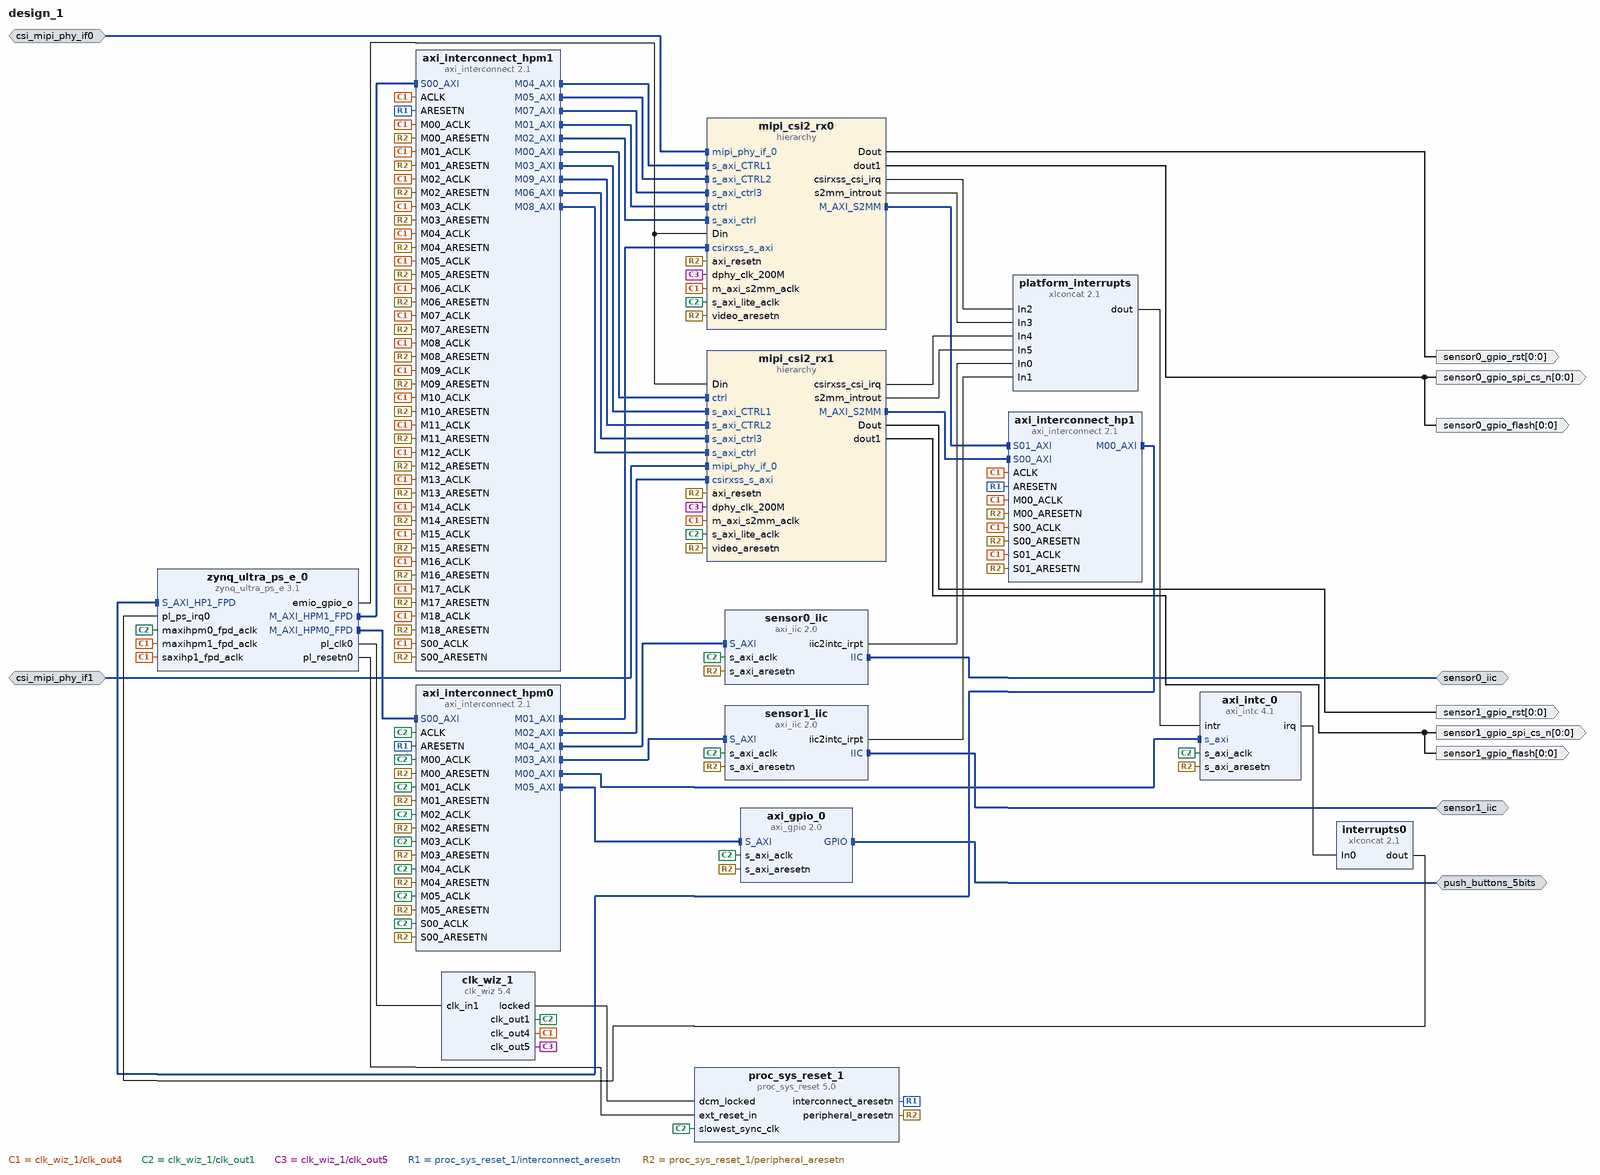
[diagram p0: block diagram of the top level]
# Vivado block design design_1, xczu9eg-ffvb1156-2-i, Vivado 2017.3
create_bd_design design_1

create_bd_intf_port -mode Slave -vlnv xilinx.com:interface:mipi_phy_rtl:1.0 csi_mipi_phy_if0
create_bd_intf_port -mode Slave -vlnv xilinx.com:interface:mipi_phy_rtl:1.0 csi_mipi_phy_if1
create_bd_intf_port -mode Master -vlnv xilinx.com:interface:gpio_rtl:1.0 push_buttons_5bits
create_bd_intf_port -mode Master -vlnv xilinx.com:interface:iic_rtl:1.0 sensor0_iic
create_bd_intf_port -mode Master -vlnv xilinx.com:interface:iic_rtl:1.0 sensor1_iic
create_bd_port -dir O -from 0 -to 0 sensor0_gpio_flash
create_bd_port -dir O -from 0 -to 0 sensor0_gpio_rst
create_bd_port -dir O -from 0 -to 0 sensor0_gpio_spi_cs_n
create_bd_port -dir O -from 0 -to 0 sensor1_gpio_flash
create_bd_port -dir O -from 0 -to 0 sensor1_gpio_rst
create_bd_port -dir O -from 0 -to 0 sensor1_gpio_spi_cs_n

create_bd_cell -type ip -vlnv xilinx.com:ip:axi_gpio:2.0 axi_gpio_0
set_property -dict {CONFIG.USE_BOARD_FLOW true CONFIG.GPIO_BOARD_INTERFACE push_buttons_5bits} [get_bd_cells axi_gpio_0]
create_bd_cell -type ip -vlnv xilinx.com:ip:axi_intc:4.1 axi_intc_0
create_bd_cell -type ip -vlnv xilinx.com:ip:axi_interconnect:2.1 axi_interconnect_hp1
set_property -dict [list \
  CONFIG.NUM_SI 2 \
  CONFIG.NUM_MI 1 \
  CONFIG.STRATEGY 2 \
  CONFIG.ENABLE_ADVANCED_OPTIONS 0 \
  CONFIG.SYNCHRONIZATION_STAGES 2 \
  CONFIG.M00_HAS_REGSLICE 1 \
  CONFIG.M00_HAS_DATA_FIFO 2 \
  CONFIG.S00_HAS_REGSLICE 1 \
  CONFIG.S01_HAS_REGSLICE 1 \
  CONFIG.S02_HAS_REGSLICE 1 \
  CONFIG.S03_HAS_REGSLICE 1 \
  CONFIG.S04_HAS_REGSLICE 1 \
  CONFIG.S05_HAS_REGSLICE 1 \
  CONFIG.S06_HAS_REGSLICE 1 \
  CONFIG.S00_HAS_DATA_FIFO 2 \
  CONFIG.S01_HAS_DATA_FIFO 2 \
  CONFIG.S02_HAS_DATA_FIFO 2 \
  CONFIG.S03_HAS_DATA_FIFO 2 \
  CONFIG.S04_HAS_DATA_FIFO 2 \
  CONFIG.S05_HAS_DATA_FIFO 2 \
  CONFIG.S06_HAS_DATA_FIFO 2 \
] [get_bd_cells axi_interconnect_hp1]
create_bd_cell -type ip -vlnv xilinx.com:ip:axi_interconnect:2.1 axi_interconnect_hpm0
set_property -dict [list \
  CONFIG.NUM_MI 6 \
  CONFIG.STRATEGY 1 \
  CONFIG.ENABLE_ADVANCED_OPTIONS 0 \
  CONFIG.SYNCHRONIZATION_STAGES 2 \
] [get_bd_cells axi_interconnect_hpm0]
create_bd_cell -type ip -vlnv xilinx.com:ip:axi_interconnect:2.1 axi_interconnect_hpm1
set_property -dict [list \
  CONFIG.NUM_MI 19 \
  CONFIG.STRATEGY 1 \
  CONFIG.ENABLE_ADVANCED_OPTIONS 0 \
  CONFIG.SYNCHRONIZATION_STAGES 2 \
  CONFIG.M00_HAS_REGSLICE 1 \
  CONFIG.M01_HAS_REGSLICE 1 \
  CONFIG.M02_HAS_REGSLICE 1 \
  CONFIG.M03_HAS_REGSLICE 1 \
  CONFIG.M04_HAS_REGSLICE 1 \
  CONFIG.M05_HAS_REGSLICE 1 \
  CONFIG.M06_HAS_REGSLICE 1 \
  CONFIG.M07_HAS_REGSLICE 1 \
  CONFIG.M08_HAS_REGSLICE 1 \
  CONFIG.M09_HAS_REGSLICE 1 \
  CONFIG.M10_HAS_REGSLICE 1 \
  CONFIG.S00_HAS_REGSLICE 1 \
] [get_bd_cells axi_interconnect_hpm1]
create_bd_cell -type ip -vlnv xilinx.com:ip:clk_wiz:5.4 clk_wiz_1
set_property -dict [list \
  CONFIG.PHASESHIFT_MODE LATENCY \
  CONFIG.USE_INCLK_SWITCHOVER false \
  CONFIG.CLKIN1_JITTER_PS 200.02 \
  CONFIG.CLKOUT2_USED true \
  CONFIG.CLKOUT3_USED true \
  CONFIG.CLKOUT4_USED true \
  CONFIG.CLKOUT5_USED true \
  CONFIG.NUM_OUT_CLKS 5 \
  CONFIG.CLKOUT1_REQUESTED_OUT_FREQ 50.000 \
  CONFIG.CLKOUT2_REQUESTED_OUT_FREQ 75.000 \
  CONFIG.CLKOUT3_REQUESTED_OUT_FREQ 150.000 \
  CONFIG.CLKOUT4_REQUESTED_OUT_FREQ 300.000 \
  CONFIG.CLKOUT5_REQUESTED_OUT_FREQ 200.000 \
  CONFIG.PRIM_SOURCE No_buffer \
  CONFIG.CLKOUT1_DRIVES Buffer \
  CONFIG.CLKOUT2_DRIVES Buffer \
  CONFIG.CLKOUT3_DRIVES Buffer \
  CONFIG.CLKOUT4_DRIVES Buffer \
  CONFIG.CLKOUT5_DRIVES Buffer \
  CONFIG.CLKOUT6_DRIVES Buffer \
  CONFIG.CLKOUT7_DRIVES Buffer \
  CONFIG.USE_RESET false \
  CONFIG.MMCM_DIVCLK_DIVIDE 1 \
  CONFIG.MMCM_CLKFBOUT_MULT_F 24.000 \
  CONFIG.MMCM_CLKIN1_PERIOD 20.002 \
  CONFIG.MMCM_CLKIN2_PERIOD 10.0 \
  CONFIG.MMCM_CLKOUT0_DIVIDE_F 24.000 \
  CONFIG.MMCM_CLKOUT1_DIVIDE 16 \
  CONFIG.MMCM_CLKOUT2_DIVIDE 8 \
  CONFIG.MMCM_CLKOUT3_DIVIDE 4 \
  CONFIG.MMCM_CLKOUT4_DIVIDE 6 \
  CONFIG.CLKOUT1_JITTER 163.726 \
  CONFIG.CLKOUT1_PHASE_ERROR 154.695 \
  CONFIG.CLKOUT2_JITTER 148.390 \
  CONFIG.CLKOUT2_PHASE_ERROR 154.695 \
  CONFIG.CLKOUT3_JITTER 129.940 \
  CONFIG.CLKOUT3_PHASE_ERROR 154.695 \
  CONFIG.CLKOUT4_JITTER 116.512 \
  CONFIG.CLKOUT4_PHASE_ERROR 154.695 \
  CONFIG.CLKOUT5_JITTER 124.151 \
  CONFIG.CLKOUT5_PHASE_ERROR 154.695 \
] [get_bd_cells clk_wiz_1]
create_bd_cell -type ip -vlnv xilinx.com:ip:xlconcat:2.1 interrupts0
set_property -dict {CONFIG.NUM_PORTS 1} [get_bd_cells interrupts0]
create_bd_cell -type hier mipi_csi2_rx0
create_bd_cell -type hier mipi_csi2_rx1
create_bd_cell -type ip -vlnv xilinx.com:ip:xlconcat:2.1 platform_interrupts
set_property -dict {CONFIG.NUM_PORTS 6} [get_bd_cells platform_interrupts]
create_bd_cell -type ip -vlnv xilinx.com:ip:proc_sys_reset:5.0 proc_sys_reset_1
set_property -dict {CONFIG.C_AUX_RESET_HIGH 0} [get_bd_cells proc_sys_reset_1]
create_bd_cell -type ip -vlnv xilinx.com:ip:axi_iic:2.0 sensor0_iic
set_property -dict {CONFIG.IIC_FREQ_KHZ 400} [get_bd_cells sensor0_iic]
create_bd_cell -type ip -vlnv xilinx.com:ip:axi_iic:2.0 sensor1_iic
set_property -dict {CONFIG.IIC_FREQ_KHZ 400} [get_bd_cells sensor1_iic]
create_bd_cell -type ip -vlnv xilinx.com:ip:zynq_ultra_ps_e:3.1 zynq_ultra_ps_e_0
set_property -dict [list \
  CONFIG.PSU__PSS_REF_CLK__FREQMHZ 33.330 \
  CONFIG.PSU__CAN1__PERIPHERAL__ENABLE 1 \
  CONFIG.PSU__CAN1__PERIPHERAL__IO {MIO 24 .. 25} \
  CONFIG.PSU__DPAUX__PERIPHERAL__ENABLE 1 \
  CONFIG.PSU__DPAUX__PERIPHERAL__IO {MIO 27 .. 30} \
  CONFIG.PSU__GEM__TSU__ENABLE 0 \
  CONFIG.PSU__FPGA_PL0_ENABLE 1 \
  CONFIG.PSU__ENET3__PERIPHERAL__ENABLE 1 \
  CONFIG.PSU__ENET3__FIFO__ENABLE 0 \
  CONFIG.PSU__ENET3__PTP__ENABLE 0 \
  CONFIG.PSU__ENET3__PERIPHERAL__IO {MIO 64 .. 75} \
  CONFIG.PSU__ENET3__GRP_MDIO__ENABLE 1 \
  CONFIG.PSU__ENET3__GRP_MDIO__IO {MIO 76 .. 77} \
  CONFIG.PSU__GPIO_EMIO__PERIPHERAL__ENABLE 1 \
  CONFIG.PSU__GPIO_EMIO__PERIPHERAL__IO 95 \
  CONFIG.PSU__GPIO0_MIO__PERIPHERAL__ENABLE 1 \
  CONFIG.PSU__GPIO0_MIO__IO {MIO 0 .. 25} \
  CONFIG.PSU__GPIO1_MIO__PERIPHERAL__ENABLE 1 \
  CONFIG.PSU__GPIO1_MIO__IO {MIO 26 .. 51} \
  CONFIG.PSU__I2C0__PERIPHERAL__ENABLE 1 \
  CONFIG.PSU__I2C0__PERIPHERAL__IO {MIO 14 .. 15} \
  CONFIG.PSU__I2C1__PERIPHERAL__ENABLE 1 \
  CONFIG.PSU__I2C1__PERIPHERAL__IO {MIO 16 .. 17} \
  CONFIG.PSU__GT__LINK_SPEED HBR \
  CONFIG.PSU__GT__VLT_SWNG_LVL_4 0 \
  CONFIG.PSU__GT__PRE_EMPH_LVL_4 0 \
  CONFIG.PSU__USB0__REF_CLK_SEL {Ref Clk2} \
  CONFIG.PSU__USB0__REF_CLK_FREQ 26 \
  CONFIG.PSU__DP__REF_CLK_SEL {Ref Clk3} \
  CONFIG.PSU__DP__REF_CLK_FREQ 27 \
  CONFIG.PSU__SATA__REF_CLK_SEL {Ref Clk1} \
  CONFIG.PSU__SATA__REF_CLK_FREQ 125 \
  CONFIG.PSU__DP__LANE_SEL {Dual Lower} \
  CONFIG.PSU__PCIE__DEVICE_ID 0xD021 \
  CONFIG.PSU__PCIE__CLASS_CODE_BASE 0x06 \
  CONFIG.PSU__PCIE__CLASS_CODE_SUB 0x4 \
  CONFIG.SUBPRESET2 Custom \
  CONFIG.PSU__PMU__AIBACK__ENABLE 0 \
  CONFIG.PSU__PMU__PLERROR__ENABLE 0 \
  CONFIG.PSU__PMU__PERIPHERAL__ENABLE 1 \
  CONFIG.PSU__PMU__EMIO_GPI__ENABLE 0 \
  CONFIG.PSU__PMU__EMIO_GPO__ENABLE 0 \
  CONFIG.PSU__PMU__GPI0__ENABLE 0 \
  CONFIG.PSU__PMU__GPI1__ENABLE 0 \
  CONFIG.PSU__PMU__GPI2__ENABLE 0 \
  CONFIG.PSU__PMU__GPI3__ENABLE 0 \
  CONFIG.PSU__PMU__GPI4__ENABLE 0 \
  CONFIG.PSU__PMU__GPI5__ENABLE 0 \
  CONFIG.PSU__PMU__GPO0__ENABLE 1 \
  CONFIG.PSU__PMU__GPO1__ENABLE 1 \
  CONFIG.PSU__PMU__GPO2__ENABLE 1 \
  CONFIG.PSU__PMU__GPO3__ENABLE 1 \
  CONFIG.PSU__PMU__GPO4__ENABLE 1 \
  CONFIG.PSU__PMU__GPO5__ENABLE 1 \
  CONFIG.PSU__PMU__GPO0__IO {MIO 32} \
  CONFIG.PSU__PMU__GPO1__IO {MIO 33} \
  CONFIG.PSU__PMU__GPO2__IO {MIO 34} \
  CONFIG.PSU__PMU__GPO3__IO {MIO 35} \
  CONFIG.PSU__PMU__GPO4__IO {MIO 36} \
  CONFIG.PSU__PMU__GPO5__IO {MIO 37} \
  CONFIG.PSU__QSPI__PERIPHERAL__ENABLE 1 \
  CONFIG.PSU__QSPI__PERIPHERAL__IO {MIO 0 .. 12} \
  CONFIG.PSU__QSPI__PERIPHERAL__MODE {Dual Parallel} \
  CONFIG.PSU__QSPI__PERIPHERAL__DATA_MODE x4 \
  CONFIG.PSU__QSPI__GRP_FBCLK__ENABLE 1 \
  CONFIG.PSU__QSPI__GRP_FBCLK__IO {MIO 6} \
  CONFIG.PSU__SD1__PERIPHERAL__ENABLE 1 \
  CONFIG.PSU__SD1__PERIPHERAL__IO {MIO 39 .. 51} \
  CONFIG.PSU__SD1__GRP_CD__ENABLE 1 \
  CONFIG.PSU__SD1__GRP_CD__IO {MIO 45} \
  CONFIG.PSU__SD1__GRP_POW__ENABLE 0 \
  CONFIG.PSU__SD1__GRP_WP__ENABLE 1 \
  CONFIG.PSU__SD1__GRP_WP__IO {MIO 44} \
  CONFIG.PSU__SD1__SLOT_TYPE {SD 3.0} \
  CONFIG.PSU__SD1__DATA_TRANSFER_MODE 8Bit \
  CONFIG.PSU__DEVICE_TYPE EG \
  CONFIG.PSU__SWDT0__PERIPHERAL__ENABLE 1 \
  CONFIG.PSU__SWDT0__CLOCK__ENABLE 0 \
  CONFIG.PSU__SWDT0__RESET__ENABLE 0 \
  CONFIG.PSU__SWDT1__PERIPHERAL__ENABLE 1 \
  CONFIG.PSU__SWDT1__CLOCK__ENABLE 0 \
  CONFIG.PSU__SWDT1__RESET__ENABLE 0 \
  CONFIG.PSU__UART0__BAUD_RATE 115200 \
  CONFIG.PSU__TTC0__PERIPHERAL__ENABLE 1 \
  CONFIG.PSU__TTC0__CLOCK__ENABLE 0 \
  CONFIG.PSU__TTC0__WAVEOUT__ENABLE 0 \
  CONFIG.PSU__TTC1__PERIPHERAL__ENABLE 1 \
  CONFIG.PSU__UART1__BAUD_RATE 115200 \
  CONFIG.PSU__TTC1__CLOCK__ENABLE 0 \
  CONFIG.PSU__TTC1__WAVEOUT__ENABLE 0 \
  CONFIG.PSU__TTC2__PERIPHERAL__ENABLE 1 \
  CONFIG.PSU__TTC2__CLOCK__ENABLE 0 \
  CONFIG.PSU__TTC2__WAVEOUT__ENABLE 0 \
  CONFIG.PSU__TTC3__PERIPHERAL__ENABLE 1 \
  CONFIG.PSU__TTC3__CLOCK__ENABLE 0 \
  CONFIG.PSU__TTC3__WAVEOUT__ENABLE 0 \
  CONFIG.PSU__CSUPMU__PERIPHERAL__VALID 1 \
  CONFIG.PSU__DDRC__BUS_WIDTH {64 Bit} \
  CONFIG.PSU__DDRC__DEVICE_CAPACITY {4096 MBits} \
  CONFIG.PSU__DDRC__DRAM_WIDTH {8 Bits} \
  CONFIG.PSU__DDRC__ECC Disabled \
  CONFIG.PSU__DDRC__MEMORY_TYPE {DDR 4} \
  CONFIG.PSU__DDRC__SPEED_BIN DDR4_2133P \
  CONFIG.PSU__DDRC__COMPONENTS UDIMM \
  CONFIG.PSU__UART0__PERIPHERAL__ENABLE 1 \
  CONFIG.PSU__UART0__PERIPHERAL__IO {MIO 18 .. 19} \
  CONFIG.PSU__UART0__MODEM__ENABLE 0 \
  CONFIG.PSU__UART1__PERIPHERAL__ENABLE 1 \
  CONFIG.PSU__UART1__PERIPHERAL__IO {MIO 20 .. 21} \
  CONFIG.PSU__UART1__MODEM__ENABLE 0 \
  CONFIG.PSU__USB0__PERIPHERAL__ENABLE 1 \
  CONFIG.PSU__USB0__PERIPHERAL__IO {MIO 52 .. 63} \
  CONFIG.PSU__USB3_0__PERIPHERAL__ENABLE 1 \
  CONFIG.PSU__USB3_0__PERIPHERAL__IO {GT Lane2} \
  CONFIG.PSU__USB3_0__EMIO__ENABLE 0 \
  CONFIG.PSU__USB2_0__EMIO__ENABLE 0 \
  CONFIG.PSU__USE__M_AXI_GP0 1 \
  CONFIG.PSU__MAXIGP0__DATA_WIDTH 32 \
  CONFIG.PSU__USE__M_AXI_GP1 1 \
  CONFIG.PSU__MAXIGP1__DATA_WIDTH 32 \
  CONFIG.PSU__USE__M_AXI_GP2 0 \
  CONFIG.PSU__USE__S_AXI_GP3 1 \
  CONFIG.PSU__USE__IRQ0 1 \
  CONFIG.PSU__PRESET_APPLIED 1 \
  CONFIG.PSU__HIGH_ADDRESS__ENABLE 1 \
  CONFIG.PSU__DDR_HIGH_ADDRESS_GUI_ENABLE 1 \
  CONFIG.PSU_BANK_0_IO_STANDARD LVCMOS18 \
  CONFIG.PSU_BANK_1_IO_STANDARD LVCMOS18 \
  CONFIG.PSU_BANK_2_IO_STANDARD LVCMOS18 \
  CONFIG.PSU_BANK_3_IO_STANDARD LVCMOS33 \
  CONFIG.PSU__DISPLAYPORT__PERIPHERAL__ENABLE 1 \
  CONFIG.PSU__DISPLAYPORT__LANE0__ENABLE 1 \
  CONFIG.PSU__DISPLAYPORT__LANE0__IO {GT Lane1} \
  CONFIG.PSU__DISPLAYPORT__LANE1__ENABLE 1 \
  CONFIG.PSU__DISPLAYPORT__LANE1__IO {GT Lane0} \
  CONFIG.PSU__SATA__PERIPHERAL__ENABLE 1 \
  CONFIG.PSU__SATA__LANE1__IO {GT Lane3} \
  CONFIG.PSU__CRL_APB__USB3__ENABLE 1 \
  CONFIG.PSU__CRF_APB__APLL_CTRL__SRCSEL PSS_REF_CLK \
  CONFIG.PSU__CRF_APB__DPLL_CTRL__SRCSEL PSS_REF_CLK \
  CONFIG.PSU__CRF_APB__VPLL_CTRL__SRCSEL PSS_REF_CLK \
  CONFIG.PSU__CRF_APB__ACPU_CTRL__SRCSEL APLL \
  CONFIG.PSU__CRF_APB__DBG_TRACE_CTRL__SRCSEL IOPLL \
  CONFIG.PSU__CRF_APB__DBG_FPD_CTRL__SRCSEL IOPLL \
  CONFIG.PSU__CRF_APB__DP_VIDEO_REF_CTRL__SRCSEL VPLL \
  CONFIG.PSU__CRF_APB__DP_AUDIO_REF_CTRL__SRCSEL RPLL \
  CONFIG.PSU__CRF_APB__DP_STC_REF_CTRL__SRCSEL RPLL \
  CONFIG.PSU__CRF_APB__DDR_CTRL__SRCSEL DPLL \
  CONFIG.PSU__CRF_APB__GPU_REF_CTRL__SRCSEL IOPLL \
  CONFIG.PSU__CRL_APB__PL0_REF_CTRL__SRCSEL IOPLL \
  CONFIG.PSU__CRF_APB__GDMA_REF_CTRL__SRCSEL APLL \
  CONFIG.PSU__CRF_APB__DPDMA_REF_CTRL__SRCSEL APLL \
  CONFIG.PSU__CRF_APB__TOPSW_MAIN_CTRL__SRCSEL DPLL \
  CONFIG.PSU__CRF_APB__TOPSW_LSBUS_CTRL__SRCSEL IOPLL \
  CONFIG.PSU__CRF_APB__DBG_TSTMP_CTRL__SRCSEL IOPLL \
  CONFIG.PSU__CRL_APB__IOPLL_CTRL__SRCSEL PSS_REF_CLK \
  CONFIG.PSU__CRL_APB__RPLL_CTRL__SRCSEL PSS_REF_CLK \
  CONFIG.PSU__CRL_APB__GEM3_REF_CTRL__SRCSEL IOPLL \
  CONFIG.PSU__CRL_APB__USB0_BUS_REF_CTRL__SRCSEL IOPLL \
  CONFIG.PSU__CRL_APB__QSPI_REF_CTRL__SRCSEL IOPLL \
  CONFIG.PSU__CRL_APB__SDIO1_REF_CTRL__SRCSEL IOPLL \
  CONFIG.PSU__CRL_APB__UART0_REF_CTRL__SRCSEL IOPLL \
  CONFIG.PSU__CRL_APB__UART1_REF_CTRL__SRCSEL IOPLL \
  CONFIG.PSU__CRL_APB__I2C0_REF_CTRL__SRCSEL IOPLL \
  CONFIG.PSU__CRL_APB__I2C1_REF_CTRL__SRCSEL IOPLL \
  CONFIG.PSU__CRL_APB__CAN1_REF_CTRL__SRCSEL IOPLL \
  CONFIG.PSU__CRL_APB__CPU_R5_CTRL__SRCSEL IOPLL \
  CONFIG.PSU__CRL_APB__IOU_SWITCH_CTRL__SRCSEL IOPLL \
  CONFIG.PSU__CRL_APB__PCAP_CTRL__SRCSEL IOPLL \
  CONFIG.PSU__CRL_APB__LPD_LSBUS_CTRL__SRCSEL IOPLL \
  CONFIG.PSU__CRL_APB__LPD_SWITCH_CTRL__SRCSEL IOPLL \
  CONFIG.PSU__CRL_APB__DBG_LPD_CTRL__SRCSEL IOPLL \
  CONFIG.PSU__CRL_APB__ADMA_REF_CTRL__SRCSEL IOPLL \
  CONFIG.PSU__CRL_APB__TIMESTAMP_REF_CTRL__SRCSEL IOPLL \
  CONFIG.PSU__CRL_APB__USB3_DUAL_REF_CTRL__SRCSEL IOPLL \
  CONFIG.PSU__IOU_SLCR__IOU_TTC_APB_CLK__TTC0_SEL APB \
  CONFIG.PSU__IOU_SLCR__IOU_TTC_APB_CLK__TTC1_SEL APB \
  CONFIG.PSU__IOU_SLCR__IOU_TTC_APB_CLK__TTC2_SEL APB \
  CONFIG.PSU__IOU_SLCR__IOU_TTC_APB_CLK__TTC3_SEL APB \
  CONFIG.PSU__OVERRIDE__BASIC_CLOCK 0 \
  CONFIG.PSU__DLL__ISUSED 1 \
  CONFIG.PSU__DDR__INTERFACE__FREQMHZ 533.500 \
  CONFIG.PSU__CRF_APB__ACPU_CTRL__FREQMHZ 1200 \
  CONFIG.PSU__CRF_APB__DBG_TRACE_CTRL__FREQMHZ 250 \
  CONFIG.PSU__CRF_APB__DBG_FPD_CTRL__FREQMHZ 250 \
  CONFIG.PSU__CRF_APB__DDR_CTRL__FREQMHZ 1067 \
  CONFIG.PSU__CRF_APB__GPU_REF_CTRL__FREQMHZ 500 \
  CONFIG.PSU__CRL_APB__PL0_REF_CTRL__FREQMHZ 50 \
  CONFIG.PSU__CRF_APB__GDMA_REF_CTRL__FREQMHZ 600 \
  CONFIG.PSU__CRF_APB__DPDMA_REF_CTRL__FREQMHZ 600 \
  CONFIG.PSU__CRF_APB__TOPSW_MAIN_CTRL__FREQMHZ 533.33 \
  CONFIG.PSU__CRF_APB__TOPSW_LSBUS_CTRL__FREQMHZ 100 \
  CONFIG.PSU__CRF_APB__DBG_TSTMP_CTRL__FREQMHZ 250 \
  CONFIG.PSU__CRL_APB__GEM3_REF_CTRL__FREQMHZ 125 \
  CONFIG.PSU__CRL_APB__USB0_BUS_REF_CTRL__FREQMHZ 250 \
  CONFIG.PSU__CRL_APB__QSPI_REF_CTRL__FREQMHZ 125 \
  CONFIG.PSU__CRL_APB__SDIO1_REF_CTRL__FREQMHZ 200 \
  CONFIG.PSU__CRL_APB__UART0_REF_CTRL__FREQMHZ 100 \
  CONFIG.PSU__CRL_APB__UART1_REF_CTRL__FREQMHZ 100 \
  CONFIG.PSU__CRL_APB__I2C0_REF_CTRL__FREQMHZ 100 \
  CONFIG.PSU__CRL_APB__I2C1_REF_CTRL__FREQMHZ 100 \
  CONFIG.PSU__CRL_APB__CAN1_REF_CTRL__FREQMHZ 100 \
  CONFIG.PSU__CRL_APB__CPU_R5_CTRL__FREQMHZ 500 \
  CONFIG.PSU__CRL_APB__IOU_SWITCH_CTRL__FREQMHZ 250 \
  CONFIG.PSU__CRL_APB__PCAP_CTRL__FREQMHZ 200 \
  CONFIG.PSU__CRL_APB__LPD_LSBUS_CTRL__FREQMHZ 100 \
  CONFIG.PSU__CRL_APB__LPD_SWITCH_CTRL__FREQMHZ 500 \
  CONFIG.PSU__CRL_APB__DBG_LPD_CTRL__FREQMHZ 250 \
  CONFIG.PSU__CRL_APB__ADMA_REF_CTRL__FREQMHZ 500 \
  CONFIG.PSU__CRL_APB__TIMESTAMP_REF_CTRL__FREQMHZ 100 \
  CONFIG.PSU__CRL_APB__USB3_DUAL_REF_CTRL__FREQMHZ 20 \
  CONFIG.PSU__LPD_SLCR__CSUPMU__FREQMHZ 100 \
  CONFIG.PSU__GPIO_EMIO_WIDTH 95 \
  CONFIG.IIC0_BOARD_INTERFACE custom \
  CONFIG.IIC1_BOARD_INTERFACE custom \
  CONFIG.QSPI_BOARD_INTERFACE custom \
  CONFIG.NAND_BOARD_INTERFACE custom \
  CONFIG.SD0_BOARD_INTERFACE custom \
  CONFIG.SD1_BOARD_INTERFACE custom \
  CONFIG.CAN0_BOARD_INTERFACE custom \
  CONFIG.CAN1_BOARD_INTERFACE custom \
  CONFIG.PJTAG_BOARD_INTERFACE custom \
  CONFIG.PMU_BOARD_INTERFACE custom \
  CONFIG.CSU_BOARD_INTERFACE custom \
  CONFIG.SPI0_BOARD_INTERFACE custom \
  CONFIG.SPI1_BOARD_INTERFACE custom \
  CONFIG.UART0_BOARD_INTERFACE custom \
  CONFIG.UART1_BOARD_INTERFACE custom \
  CONFIG.GPIO_BOARD_INTERFACE custom \
  CONFIG.SWDT0_BOARD_INTERFACE custom \
  CONFIG.SWDT1_BOARD_INTERFACE custom \
  CONFIG.TRACE_BOARD_INTERFACE custom \
  CONFIG.TTC0_BOARD_INTERFACE custom \
  CONFIG.TTC1_BOARD_INTERFACE custom \
  CONFIG.TTC2_BOARD_INTERFACE custom \
  CONFIG.TTC3_BOARD_INTERFACE custom \
  CONFIG.GEM0_BOARD_INTERFACE custom \
  CONFIG.GEM1_BOARD_INTERFACE custom \
  CONFIG.GEM2_BOARD_INTERFACE custom \
  CONFIG.GEM3_BOARD_INTERFACE custom \
  CONFIG.USB0_BOARD_INTERFACE custom \
  CONFIG.USB1_BOARD_INTERFACE custom \
  CONFIG.PCIE_BOARD_INTERFACE custom \
  CONFIG.DP_BOARD_INTERFACE custom \
  CONFIG.SATA_BOARD_INTERFACE custom \
  CONFIG.PSU__PMU_COHERENCY 0 \
  CONFIG.PSU__USB0_COHERENCY 0 \
  CONFIG.PSU__SD1_COHERENCY 0 \
  CONFIG.PSU__QSPI_COHERENCY 0 \
  CONFIG.PSU__ENET3__TSU__ENABLE 0 \
  CONFIG.PSU__GEM3_COHERENCY 0 \
] [get_bd_cells zynq_ultra_ps_e_0]
# 711 more settings of zynq_ultra_ps_e_0 are not shown: defaults, MIO pin electricals, DDR timing, and values the tool derives

# ---- hierarchy /mipi_csi2_rx0 ----
current_bd_instance /mipi_csi2_rx0
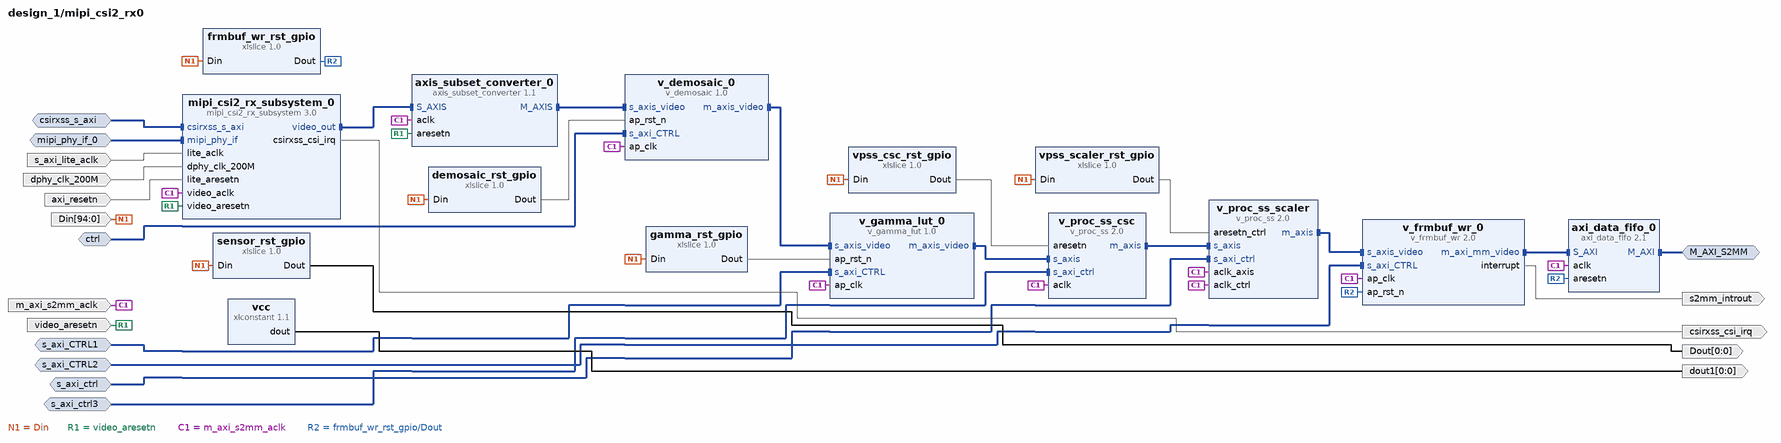
[diagram p1: block diagram inside /mipi_csi2_rx0]
create_bd_intf_pin -mode Master -vlnv xilinx.com:interface:aximm_rtl:1.0 M_AXI_S2MM
create_bd_intf_pin -mode Slave -vlnv xilinx.com:interface:aximm_rtl:1.0 csirxss_s_axi
create_bd_intf_pin -mode Slave -vlnv xilinx.com:interface:aximm_rtl:1.0 ctrl
create_bd_intf_pin -mode Slave -vlnv xilinx.com:interface:mipi_phy_rtl:1.0 mipi_phy_if_0
create_bd_intf_pin -mode Slave -vlnv xilinx.com:interface:aximm_rtl:1.0 s_axi_CTRL1
create_bd_intf_pin -mode Slave -vlnv xilinx.com:interface:aximm_rtl:1.0 s_axi_CTRL2
create_bd_intf_pin -mode Slave -vlnv xilinx.com:interface:aximm_rtl:1.0 s_axi_ctrl
create_bd_intf_pin -mode Slave -vlnv xilinx.com:interface:aximm_rtl:1.0 s_axi_ctrl3
create_bd_pin -dir I -from 94 -to 0 Din
create_bd_pin -dir O -from 0 -to 0 Dout
create_bd_pin -dir I -type rst axi_resetn
create_bd_pin -dir O -type intr csirxss_csi_irq
create_bd_pin -dir O -from 0 -to 0 dout1
create_bd_pin -dir I -type clk dphy_clk_200M
create_bd_pin -dir I -type clk m_axi_s2mm_aclk
create_bd_pin -dir O -type intr s2mm_introut
create_bd_pin -dir I -type clk s_axi_lite_aclk
create_bd_pin -dir I -type rst video_aresetn

create_bd_cell -type ip -vlnv xilinx.com:ip:axi_data_fifo:2.1 axi_data_fifo_0
set_property -dict {CONFIG.WRITE_FIFO_DEPTH 512 CONFIG.WRITE_FIFO_DELAY 1} [get_bd_cells axi_data_fifo_0]
create_bd_cell -type ip -vlnv xilinx.com:ip:axis_subset_converter:1.1 axis_subset_converter_0
set_property -dict [list \
  CONFIG.S_TDATA_NUM_BYTES 3 \
  CONFIG.M_TDATA_NUM_BYTES 2 \
  CONFIG.TDATA_REMAP {tdata[19:12],tdata[9:2]} \
] [get_bd_cells axis_subset_converter_0]
create_bd_cell -type ip -vlnv xilinx.com:ip:xlslice:1.0 demosaic_rst_gpio
set_property -dict {CONFIG.DIN_TO 7 CONFIG.DIN_FROM 7 CONFIG.DIN_WIDTH 95 CONFIG.DOUT_WIDTH 1} [get_bd_cells demosaic_rst_gpio]
create_bd_cell -type ip -vlnv xilinx.com:ip:xlslice:1.0 frmbuf_wr_rst_gpio
set_property -dict {CONFIG.DIN_TO 2 CONFIG.DIN_FROM 2 CONFIG.DIN_WIDTH 95 CONFIG.DOUT_WIDTH 1} [get_bd_cells frmbuf_wr_rst_gpio]
create_bd_cell -type ip -vlnv xilinx.com:ip:xlslice:1.0 gamma_rst_gpio
set_property -dict {CONFIG.DIN_TO 8 CONFIG.DIN_FROM 8 CONFIG.DIN_WIDTH 95 CONFIG.DOUT_WIDTH 1} [get_bd_cells gamma_rst_gpio]
create_bd_cell -type ip -vlnv xilinx.com:ip:mipi_csi2_rx_subsystem:3.0 mipi_csi2_rx_subsystem_0
set_property -dict [list \
  CONFIG.C_CSI_EN_ACTIVELANES true \
  CONFIG.C_EN_BG0_PIN0 false \
  CONFIG.C_EN_BG1_PIN0 false \
  CONFIG.C_EN_BG3_PIN0 false \
  CONFIG.CMN_PXL_FORMAT RAW10 \
  CONFIG.CMN_NUM_LANES 4 \
  CONFIG.C_DPHY_LANES 4 \
  CONFIG.CMN_NUM_PIXELS 2 \
  CONFIG.CMN_INC_IIC false \
  CONFIG.CMN_PROJ_FAMILY 1 \
  CONFIG.C_HS_LINE_RATE 1440 \
  CONFIG.DPY_LINE_RATE 1440 \
  CONFIG.DPY_EN_REG_IF false \
  CONFIG.CSI_BUF_DEPTH 4096 \
  CONFIG.HP_IO_BANK_SELECTION 66 \
  CONFIG.CLK_LANE_IO_LOC Y4 \
  CONFIG.DATA_LANE0_IO_LOC W5 \
  CONFIG.DATA_LANE1_IO_LOC AB4 \
  CONFIG.DATA_LANE2_IO_LOC V4 \
  CONFIG.DATA_LANE3_IO_LOC U5 \
  CONFIG.DATA_LANE1_BYTE All_Byte \
  CONFIG.DATA_LANE2_BYTE All_Byte \
  CONFIG.DATA_LANE3_BYTE All_Byte \
  CONFIG.SupportLevel 1 \
  CONFIG.C_CLK_LANE_IO_POSITION 26 \
  CONFIG.C_DATA_LANE0_IO_POSITION 30 \
  CONFIG.C_DATA_LANE1_IO_POSITION 32 \
  CONFIG.C_DATA_LANE2_IO_POSITION 34 \
  CONFIG.C_DATA_LANE3_IO_POSITION 36 \
  CONFIG.C_HS_SETTLE_NS 141 \
  CONFIG.C_CSI_FILTER_USERDATATYPE true \
] [get_bd_cells mipi_csi2_rx_subsystem_0]
create_bd_cell -type ip -vlnv xilinx.com:ip:xlslice:1.0 sensor_rst_gpio
set_property -dict {CONFIG.DIN_TO 12 CONFIG.DIN_FROM 12 CONFIG.DIN_WIDTH 95 CONFIG.DOUT_WIDTH 1} [get_bd_cells sensor_rst_gpio]
create_bd_cell -type ip -vlnv xilinx.com:ip:v_demosaic:1.0 v_demosaic_0
set_property -dict {CONFIG.SAMPLES_PER_CLOCK 2 CONFIG.ENABLE_ZIPPER_REMOVAL false} [get_bd_cells v_demosaic_0]
create_bd_cell -type ip -vlnv xilinx.com:ip:v_frmbuf_wr:2.0 v_frmbuf_wr_0
set_property -dict [list \
  CONFIG.C_M_AXI_MM_VIDEO_DATA_WIDTH 128 \
  CONFIG.SAMPLES_PER_CLOCK 2 \
  CONFIG.AXIMM_DATA_WIDTH 128 \
  CONFIG.HAS_RGBX8 0 \
  CONFIG.HAS_YUVX8 0 \
  CONFIG.HAS_YUYV8 1 \
  CONFIG.HAS_Y_UV8 0 \
  CONFIG.HAS_Y_UV8_420 0 \
  CONFIG.HAS_RGB8 0 \
  CONFIG.HAS_YUV8 0 \
  CONFIG.HAS_Y8 1 \
  CONFIG.HAS_UYVY8 1 \
  CONFIG.MAX_NR_PLANES 1 \
] [get_bd_cells v_frmbuf_wr_0]
create_bd_cell -type ip -vlnv xilinx.com:ip:v_gamma_lut:1.0 v_gamma_lut_0
set_property -dict {CONFIG.SAMPLES_PER_CLOCK 2} [get_bd_cells v_gamma_lut_0]
create_bd_cell -type ip -vlnv xilinx.com:ip:v_proc_ss:2.0 v_proc_ss_csc
set_property -dict [list \
  CONFIG.C_TOPOLOGY 3 \
  CONFIG.C_SAMPLES_PER_CLK 2 \
  CONFIG.C_MAX_DATA_WIDTH 8 \
  CONFIG.C_CSC_ENABLE_WINDOW false \
  CONFIG.C_COLORSPACE_SUPPORT 2 \
] [get_bd_cells v_proc_ss_csc]
create_bd_cell -type ip -vlnv xilinx.com:ip:v_proc_ss:2.0 v_proc_ss_scaler
set_property -dict [list \
  CONFIG.C_TOPOLOGY 0 \
  CONFIG.C_SAMPLES_PER_CLK 2 \
  CONFIG.C_MAX_DATA_WIDTH 8 \
  CONFIG.C_H_SCALER_TAPS 8 \
  CONFIG.C_V_SCALER_TAPS 8 \
  CONFIG.C_ENABLE_CSC true \
  CONFIG.C_COLORSPACE_SUPPORT 1 \
] [get_bd_cells v_proc_ss_scaler]
create_bd_cell -type ip -vlnv xilinx.com:ip:xlconstant:1.1 vcc
create_bd_cell -type ip -vlnv xilinx.com:ip:xlslice:1.0 vpss_csc_rst_gpio
set_property -dict {CONFIG.DIN_TO 6 CONFIG.DIN_FROM 6 CONFIG.DIN_WIDTH 95 CONFIG.DOUT_WIDTH 1} [get_bd_cells vpss_csc_rst_gpio]
create_bd_cell -type ip -vlnv xilinx.com:ip:xlslice:1.0 vpss_scaler_rst_gpio
set_property -dict {CONFIG.DIN_TO 4 CONFIG.DIN_FROM 4 CONFIG.DIN_WIDTH 95 CONFIG.DOUT_WIDTH 1} [get_bd_cells vpss_scaler_rst_gpio]

# ---- hierarchy /mipi_csi2_rx1 ----
current_bd_instance /mipi_csi2_rx1
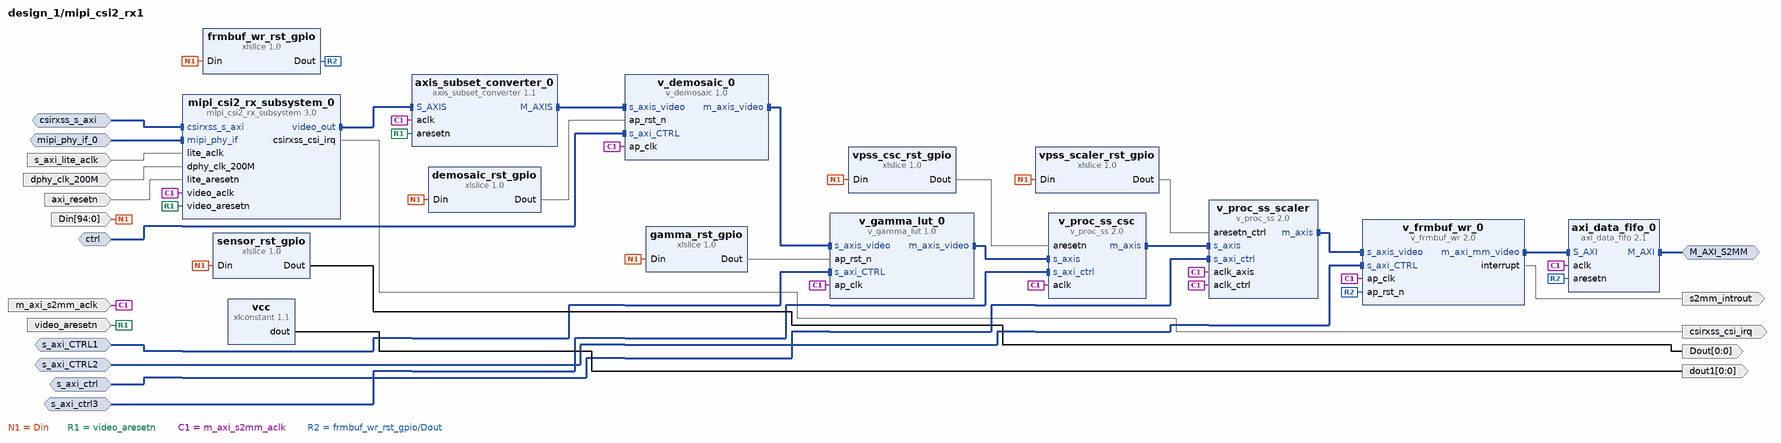
[diagram p2: block diagram inside /mipi_csi2_rx1]
create_bd_intf_pin -mode Master -vlnv xilinx.com:interface:aximm_rtl:1.0 M_AXI_S2MM
create_bd_intf_pin -mode Slave -vlnv xilinx.com:interface:aximm_rtl:1.0 csirxss_s_axi
create_bd_intf_pin -mode Slave -vlnv xilinx.com:interface:aximm_rtl:1.0 ctrl
create_bd_intf_pin -mode Slave -vlnv xilinx.com:interface:mipi_phy_rtl:1.0 mipi_phy_if_0
create_bd_intf_pin -mode Slave -vlnv xilinx.com:interface:aximm_rtl:1.0 s_axi_CTRL1
create_bd_intf_pin -mode Slave -vlnv xilinx.com:interface:aximm_rtl:1.0 s_axi_CTRL2
create_bd_intf_pin -mode Slave -vlnv xilinx.com:interface:aximm_rtl:1.0 s_axi_ctrl
create_bd_intf_pin -mode Slave -vlnv xilinx.com:interface:aximm_rtl:1.0 s_axi_ctrl3
create_bd_pin -dir I -from 94 -to 0 Din
create_bd_pin -dir O -from 0 -to 0 Dout
create_bd_pin -dir I -type rst axi_resetn
create_bd_pin -dir O -type intr csirxss_csi_irq
create_bd_pin -dir O -from 0 -to 0 dout1
create_bd_pin -dir I -type clk dphy_clk_200M
create_bd_pin -dir I -type clk m_axi_s2mm_aclk
create_bd_pin -dir O -type intr s2mm_introut
create_bd_pin -dir I -type clk s_axi_lite_aclk
create_bd_pin -dir I -type rst video_aresetn

create_bd_cell -type ip -vlnv xilinx.com:ip:axi_data_fifo:2.1 axi_data_fifo_0
set_property -dict {CONFIG.WRITE_FIFO_DEPTH 512 CONFIG.WRITE_FIFO_DELAY 1} [get_bd_cells axi_data_fifo_0]
create_bd_cell -type ip -vlnv xilinx.com:ip:axis_subset_converter:1.1 axis_subset_converter_0
set_property -dict [list \
  CONFIG.S_TDATA_NUM_BYTES 3 \
  CONFIG.M_TDATA_NUM_BYTES 2 \
  CONFIG.TDATA_REMAP {tdata[19:12],tdata[9:2]} \
] [get_bd_cells axis_subset_converter_0]
create_bd_cell -type ip -vlnv xilinx.com:ip:xlslice:1.0 demosaic_rst_gpio
set_property -dict {CONFIG.DIN_TO 7 CONFIG.DIN_FROM 7 CONFIG.DIN_WIDTH 95 CONFIG.DOUT_WIDTH 1} [get_bd_cells demosaic_rst_gpio]
create_bd_cell -type ip -vlnv xilinx.com:ip:xlslice:1.0 frmbuf_wr_rst_gpio
set_property -dict {CONFIG.DIN_TO 2 CONFIG.DIN_FROM 2 CONFIG.DIN_WIDTH 95 CONFIG.DOUT_WIDTH 1} [get_bd_cells frmbuf_wr_rst_gpio]
create_bd_cell -type ip -vlnv xilinx.com:ip:xlslice:1.0 gamma_rst_gpio
set_property -dict {CONFIG.DIN_TO 8 CONFIG.DIN_FROM 8 CONFIG.DIN_WIDTH 95 CONFIG.DOUT_WIDTH 1} [get_bd_cells gamma_rst_gpio]
create_bd_cell -type ip -vlnv xilinx.com:ip:mipi_csi2_rx_subsystem:3.0 mipi_csi2_rx_subsystem_0
set_property -dict [list \
  CONFIG.C_CSI_EN_ACTIVELANES true \
  CONFIG.C_EN_BG0_PIN0 false \
  CONFIG.C_EN_BG1_PIN0 false \
  CONFIG.C_EN_BG3_PIN0 false \
  CONFIG.CMN_PXL_FORMAT RAW10 \
  CONFIG.CMN_NUM_LANES 4 \
  CONFIG.C_DPHY_LANES 4 \
  CONFIG.CMN_NUM_PIXELS 2 \
  CONFIG.CMN_INC_IIC false \
  CONFIG.CMN_PROJ_FAMILY 1 \
  CONFIG.C_HS_LINE_RATE 1440 \
  CONFIG.DPY_LINE_RATE 1440 \
  CONFIG.DPY_EN_REG_IF false \
  CONFIG.CSI_BUF_DEPTH 4096 \
  CONFIG.HP_IO_BANK_SELECTION 65 \
  CONFIG.CLK_LANE_IO_LOC AE5 \
  CONFIG.DATA_LANE0_IO_LOC AH4 \
  CONFIG.DATA_LANE1_IO_LOC AJ6 \
  CONFIG.DATA_LANE2_IO_LOC AE3 \
  CONFIG.DATA_LANE3_IO_LOC AD4 \
  CONFIG.DATA_LANE1_BYTE All_Byte \
  CONFIG.DATA_LANE2_BYTE All_Byte \
  CONFIG.DATA_LANE3_BYTE All_Byte \
  CONFIG.SupportLevel 1 \
  CONFIG.C_CLK_LANE_IO_POSITION 26 \
  CONFIG.C_DATA_LANE0_IO_POSITION 30 \
  CONFIG.C_DATA_LANE1_IO_POSITION 32 \
  CONFIG.C_DATA_LANE2_IO_POSITION 34 \
  CONFIG.C_DATA_LANE3_IO_POSITION 36 \
  CONFIG.C_HS_SETTLE_NS 141 \
  CONFIG.C_CSI_FILTER_USERDATATYPE true \
] [get_bd_cells mipi_csi2_rx_subsystem_0]
create_bd_cell -type ip -vlnv xilinx.com:ip:xlslice:1.0 sensor_rst_gpio
set_property -dict {CONFIG.DIN_TO 12 CONFIG.DIN_FROM 12 CONFIG.DIN_WIDTH 95 CONFIG.DOUT_WIDTH 1} [get_bd_cells sensor_rst_gpio]
create_bd_cell -type ip -vlnv xilinx.com:ip:v_demosaic:1.0 v_demosaic_0
set_property -dict {CONFIG.SAMPLES_PER_CLOCK 2 CONFIG.ENABLE_ZIPPER_REMOVAL false} [get_bd_cells v_demosaic_0]
create_bd_cell -type ip -vlnv xilinx.com:ip:v_frmbuf_wr:2.0 v_frmbuf_wr_0
set_property -dict [list \
  CONFIG.C_M_AXI_MM_VIDEO_DATA_WIDTH 128 \
  CONFIG.SAMPLES_PER_CLOCK 2 \
  CONFIG.AXIMM_DATA_WIDTH 128 \
  CONFIG.HAS_RGBX8 0 \
  CONFIG.HAS_YUVX8 0 \
  CONFIG.HAS_YUYV8 1 \
  CONFIG.HAS_Y_UV8 0 \
  CONFIG.HAS_Y_UV8_420 0 \
  CONFIG.HAS_RGB8 0 \
  CONFIG.HAS_YUV8 0 \
  CONFIG.HAS_Y8 1 \
  CONFIG.HAS_UYVY8 1 \
  CONFIG.MAX_NR_PLANES 1 \
] [get_bd_cells v_frmbuf_wr_0]
create_bd_cell -type ip -vlnv xilinx.com:ip:v_gamma_lut:1.0 v_gamma_lut_0
set_property -dict {CONFIG.SAMPLES_PER_CLOCK 2} [get_bd_cells v_gamma_lut_0]
create_bd_cell -type ip -vlnv xilinx.com:ip:v_proc_ss:2.0 v_proc_ss_csc
set_property -dict [list \
  CONFIG.C_TOPOLOGY 3 \
  CONFIG.C_SAMPLES_PER_CLK 2 \
  CONFIG.C_MAX_DATA_WIDTH 8 \
  CONFIG.C_CSC_ENABLE_WINDOW false \
  CONFIG.C_COLORSPACE_SUPPORT 2 \
] [get_bd_cells v_proc_ss_csc]
create_bd_cell -type ip -vlnv xilinx.com:ip:v_proc_ss:2.0 v_proc_ss_scaler
set_property -dict [list \
  CONFIG.C_TOPOLOGY 0 \
  CONFIG.C_SAMPLES_PER_CLK 2 \
  CONFIG.C_MAX_DATA_WIDTH 8 \
  CONFIG.C_H_SCALER_TAPS 8 \
  CONFIG.C_V_SCALER_TAPS 8 \
  CONFIG.C_ENABLE_CSC true \
  CONFIG.C_COLORSPACE_SUPPORT 1 \
] [get_bd_cells v_proc_ss_scaler]
create_bd_cell -type ip -vlnv xilinx.com:ip:xlconstant:1.1 vcc
create_bd_cell -type ip -vlnv xilinx.com:ip:xlslice:1.0 vpss_csc_rst_gpio
set_property -dict {CONFIG.DIN_TO 6 CONFIG.DIN_FROM 6 CONFIG.DIN_WIDTH 95 CONFIG.DOUT_WIDTH 1} [get_bd_cells vpss_csc_rst_gpio]
create_bd_cell -type ip -vlnv xilinx.com:ip:xlslice:1.0 vpss_scaler_rst_gpio
set_property -dict {CONFIG.DIN_TO 4 CONFIG.DIN_FROM 4 CONFIG.DIN_WIDTH 95 CONFIG.DOUT_WIDTH 1} [get_bd_cells vpss_scaler_rst_gpio]

# ---- connections ----

current_bd_instance /mipi_csi2_rx0
connect_bd_intf_net [get_bd_intf_pins axis_subset_converter_0/M_AXIS] [get_bd_intf_pins v_demosaic_0/s_axis_video]
connect_bd_intf_net [get_bd_intf_pins axis_subset_converter_0/S_AXIS] [get_bd_intf_pins mipi_csi2_rx_subsystem_0/video_out]
connect_bd_intf_net [get_bd_intf_pins v_demosaic_0/m_axis_video] [get_bd_intf_pins v_gamma_lut_0/s_axis_video]
connect_bd_intf_net [get_bd_intf_pins axi_data_fifo_0/S_AXI] [get_bd_intf_pins v_frmbuf_wr_0/m_axi_mm_video]
connect_bd_intf_net [get_bd_intf_pins v_gamma_lut_0/m_axis_video] [get_bd_intf_pins v_proc_ss_csc/s_axis]
connect_bd_intf_net [get_bd_intf_pins v_frmbuf_wr_0/s_axis_video] [get_bd_intf_pins v_proc_ss_scaler/m_axis]
connect_bd_intf_net [get_bd_intf_pins v_proc_ss_csc/m_axis] [get_bd_intf_pins v_proc_ss_scaler/s_axis]
connect_bd_intf_net [get_bd_intf_pins M_AXI_S2MM] [get_bd_intf_pins axi_data_fifo_0/M_AXI]
connect_bd_intf_net [get_bd_intf_pins csirxss_s_axi] [get_bd_intf_pins mipi_csi2_rx_subsystem_0/csirxss_s_axi]
connect_bd_intf_net [get_bd_intf_pins ctrl] [get_bd_intf_pins v_demosaic_0/s_axi_CTRL]
connect_bd_intf_net [get_bd_intf_pins mipi_phy_if_0] [get_bd_intf_pins mipi_csi2_rx_subsystem_0/mipi_phy_if]
connect_bd_intf_net [get_bd_intf_pins s_axi_CTRL1] [get_bd_intf_pins v_gamma_lut_0/s_axi_CTRL]
connect_bd_intf_net [get_bd_intf_pins s_axi_CTRL2] [get_bd_intf_pins v_frmbuf_wr_0/s_axi_CTRL]
connect_bd_intf_net [get_bd_intf_pins s_axi_ctrl] [get_bd_intf_pins v_proc_ss_scaler/s_axi_ctrl]
connect_bd_intf_net [get_bd_intf_pins s_axi_ctrl3] [get_bd_intf_pins v_proc_ss_csc/s_axi_ctrl]
connect_bd_net [get_bd_pins Din] \
  [get_bd_pins demosaic_rst_gpio/Din] [get_bd_pins frmbuf_wr_rst_gpio/Din] [get_bd_pins gamma_rst_gpio/Din] \
  [get_bd_pins sensor_rst_gpio/Din] [get_bd_pins vpss_csc_rst_gpio/Din] [get_bd_pins vpss_scaler_rst_gpio/Din]
connect_bd_net -net M06_ARESETN_1 [get_bd_pins video_aresetn] \
  [get_bd_pins axis_subset_converter_0/aresetn] [get_bd_pins mipi_csi2_rx_subsystem_0/video_aresetn]
connect_bd_net -net clk_150mhz [get_bd_pins m_axi_s2mm_aclk] \
  [get_bd_pins axi_data_fifo_0/aclk] [get_bd_pins axis_subset_converter_0/aclk] \
  [get_bd_pins mipi_csi2_rx_subsystem_0/video_aclk] [get_bd_pins v_demosaic_0/ap_clk] [get_bd_pins v_frmbuf_wr_0/ap_clk] \
  [get_bd_pins v_gamma_lut_0/ap_clk] [get_bd_pins v_proc_ss_csc/aclk] [get_bd_pins v_proc_ss_scaler/aclk_axis] \
  [get_bd_pins v_proc_ss_scaler/aclk_ctrl]
connect_bd_net -net clk_50mhz [get_bd_pins s_axi_lite_aclk] [get_bd_pins mipi_csi2_rx_subsystem_0/lite_aclk]
connect_bd_net -net clk_wiz_0_clk_out3 [get_bd_pins dphy_clk_200M] [get_bd_pins mipi_csi2_rx_subsystem_0/dphy_clk_200M]
connect_bd_net [get_bd_pins demosaic_rst_gpio/Dout] [get_bd_pins v_demosaic_0/ap_rst_n]
connect_bd_net -net frmbuf_wr_rst_gpio1_Dout [get_bd_pins vpss_scaler_rst_gpio/Dout] [get_bd_pins v_proc_ss_scaler/aresetn_ctrl]
connect_bd_net [get_bd_pins gamma_rst_gpio/Dout] [get_bd_pins v_gamma_lut_0/ap_rst_n]
connect_bd_net [get_bd_pins mipi_csi2_rx_subsystem_0/csirxss_csi_irq] [get_bd_pins csirxss_csi_irq]
connect_bd_net -net proc_sys_reset_clk50_peripheral_aresetn [get_bd_pins axi_resetn] [get_bd_pins mipi_csi2_rx_subsystem_0/lite_aresetn]
connect_bd_net [get_bd_pins sensor_rst_gpio/Dout] [get_bd_pins Dout]
connect_bd_net -net tpg_rst_gpio_Dout [get_bd_pins frmbuf_wr_rst_gpio/Dout] [get_bd_pins axi_data_fifo_0/aresetn] [get_bd_pins v_frmbuf_wr_0/ap_rst_n]
connect_bd_net [get_bd_pins v_frmbuf_wr_0/interrupt] [get_bd_pins s2mm_introut]
connect_bd_net [get_bd_pins vcc/dout] [get_bd_pins dout1]
connect_bd_net [get_bd_pins vpss_csc_rst_gpio/Dout] [get_bd_pins v_proc_ss_csc/aresetn]

current_bd_instance /mipi_csi2_rx1
connect_bd_intf_net [get_bd_intf_pins axis_subset_converter_0/M_AXIS] [get_bd_intf_pins v_demosaic_0/s_axis_video]
connect_bd_intf_net [get_bd_intf_pins axis_subset_converter_0/S_AXIS] [get_bd_intf_pins mipi_csi2_rx_subsystem_0/video_out]
connect_bd_intf_net [get_bd_intf_pins v_demosaic_0/m_axis_video] [get_bd_intf_pins v_gamma_lut_0/s_axis_video]
connect_bd_intf_net [get_bd_intf_pins axi_data_fifo_0/S_AXI] [get_bd_intf_pins v_frmbuf_wr_0/m_axi_mm_video]
connect_bd_intf_net [get_bd_intf_pins v_gamma_lut_0/m_axis_video] [get_bd_intf_pins v_proc_ss_csc/s_axis]
connect_bd_intf_net [get_bd_intf_pins v_frmbuf_wr_0/s_axis_video] [get_bd_intf_pins v_proc_ss_scaler/m_axis]
connect_bd_intf_net [get_bd_intf_pins v_proc_ss_csc/m_axis] [get_bd_intf_pins v_proc_ss_scaler/s_axis]
connect_bd_intf_net [get_bd_intf_pins M_AXI_S2MM] [get_bd_intf_pins axi_data_fifo_0/M_AXI]
connect_bd_intf_net [get_bd_intf_pins csirxss_s_axi] [get_bd_intf_pins mipi_csi2_rx_subsystem_0/csirxss_s_axi]
connect_bd_intf_net [get_bd_intf_pins ctrl] [get_bd_intf_pins v_demosaic_0/s_axi_CTRL]
connect_bd_intf_net [get_bd_intf_pins mipi_phy_if_0] [get_bd_intf_pins mipi_csi2_rx_subsystem_0/mipi_phy_if]
connect_bd_intf_net [get_bd_intf_pins s_axi_CTRL1] [get_bd_intf_pins v_gamma_lut_0/s_axi_CTRL]
connect_bd_intf_net [get_bd_intf_pins s_axi_CTRL2] [get_bd_intf_pins v_frmbuf_wr_0/s_axi_CTRL]
connect_bd_intf_net [get_bd_intf_pins s_axi_ctrl] [get_bd_intf_pins v_proc_ss_scaler/s_axi_ctrl]
connect_bd_intf_net [get_bd_intf_pins s_axi_ctrl3] [get_bd_intf_pins v_proc_ss_csc/s_axi_ctrl]
connect_bd_net [get_bd_pins Din] \
  [get_bd_pins demosaic_rst_gpio/Din] [get_bd_pins frmbuf_wr_rst_gpio/Din] [get_bd_pins gamma_rst_gpio/Din] \
  [get_bd_pins sensor_rst_gpio/Din] [get_bd_pins vpss_csc_rst_gpio/Din] [get_bd_pins vpss_scaler_rst_gpio/Din]
connect_bd_net -net M06_ARESETN_1 [get_bd_pins video_aresetn] \
  [get_bd_pins axis_subset_converter_0/aresetn] [get_bd_pins mipi_csi2_rx_subsystem_0/video_aresetn]
connect_bd_net -net clk_150mhz [get_bd_pins m_axi_s2mm_aclk] \
  [get_bd_pins axi_data_fifo_0/aclk] [get_bd_pins axis_subset_converter_0/aclk] \
  [get_bd_pins mipi_csi2_rx_subsystem_0/video_aclk] [get_bd_pins v_demosaic_0/ap_clk] [get_bd_pins v_frmbuf_wr_0/ap_clk] \
  [get_bd_pins v_gamma_lut_0/ap_clk] [get_bd_pins v_proc_ss_csc/aclk] [get_bd_pins v_proc_ss_scaler/aclk_axis] \
  [get_bd_pins v_proc_ss_scaler/aclk_ctrl]
connect_bd_net -net clk_50mhz [get_bd_pins s_axi_lite_aclk] [get_bd_pins mipi_csi2_rx_subsystem_0/lite_aclk]
connect_bd_net -net clk_wiz_0_clk_out3 [get_bd_pins dphy_clk_200M] [get_bd_pins mipi_csi2_rx_subsystem_0/dphy_clk_200M]
connect_bd_net [get_bd_pins demosaic_rst_gpio/Dout] [get_bd_pins v_demosaic_0/ap_rst_n]
connect_bd_net -net frmbuf_wr_rst_gpio1_Dout [get_bd_pins vpss_scaler_rst_gpio/Dout] [get_bd_pins v_proc_ss_scaler/aresetn_ctrl]
connect_bd_net [get_bd_pins gamma_rst_gpio/Dout] [get_bd_pins v_gamma_lut_0/ap_rst_n]
connect_bd_net [get_bd_pins mipi_csi2_rx_subsystem_0/csirxss_csi_irq] [get_bd_pins csirxss_csi_irq]
connect_bd_net -net proc_sys_reset_clk50_peripheral_aresetn [get_bd_pins axi_resetn] [get_bd_pins mipi_csi2_rx_subsystem_0/lite_aresetn]
connect_bd_net [get_bd_pins sensor_rst_gpio/Dout] [get_bd_pins Dout]
connect_bd_net -net tpg_rst_gpio_Dout [get_bd_pins frmbuf_wr_rst_gpio/Dout] [get_bd_pins axi_data_fifo_0/aresetn] [get_bd_pins v_frmbuf_wr_0/ap_rst_n]
connect_bd_net [get_bd_pins v_frmbuf_wr_0/interrupt] [get_bd_pins s2mm_introut]
connect_bd_net [get_bd_pins vcc/dout] [get_bd_pins dout1]
connect_bd_net [get_bd_pins vpss_csc_rst_gpio/Dout] [get_bd_pins v_proc_ss_csc/aresetn]

current_bd_instance /
connect_bd_intf_net [get_bd_intf_pins axi_interconnect_hp1/M00_AXI] [get_bd_intf_pins zynq_ultra_ps_e_0/S_AXI_HP1_FPD]
connect_bd_intf_net [get_bd_intf_pins axi_intc_0/s_axi] [get_bd_intf_pins axi_interconnect_hpm0/M00_AXI]
connect_bd_intf_net [get_bd_intf_pins axi_interconnect_hpm0/M01_AXI] [get_bd_intf_pins mipi_csi2_rx0/csirxss_s_axi]
connect_bd_intf_net [get_bd_intf_pins axi_interconnect_hpm0/M02_AXI] [get_bd_intf_pins mipi_csi2_rx1/csirxss_s_axi]
connect_bd_intf_net [get_bd_intf_pins axi_interconnect_hpm0/M03_AXI] [get_bd_intf_pins sensor1_iic/S_AXI]
connect_bd_intf_net [get_bd_intf_pins axi_interconnect_hpm0/M04_AXI] [get_bd_intf_pins sensor0_iic/S_AXI]
connect_bd_intf_net [get_bd_intf_pins axi_gpio_0/S_AXI] [get_bd_intf_pins axi_interconnect_hpm0/M05_AXI]
connect_bd_intf_net [get_bd_intf_pins axi_interconnect_hpm1/M00_AXI] [get_bd_intf_pins mipi_csi2_rx1/ctrl]
connect_bd_intf_net [get_bd_intf_pins axi_interconnect_hpm1/M03_AXI] [get_bd_intf_pins mipi_csi2_rx1/s_axi_CTRL1]
connect_bd_intf_net [get_bd_intf_pins axi_interconnect_hpm1/M04_AXI] [get_bd_intf_pins mipi_csi2_rx0/s_axi_CTRL1]
connect_bd_intf_net [get_bd_intf_pins axi_interconnect_hpm1/M05_AXI] [get_bd_intf_pins mipi_csi2_rx0/s_axi_CTRL2]
connect_bd_intf_net [get_bd_intf_pins axi_interconnect_hpm1/M07_AXI] [get_bd_intf_pins mipi_csi2_rx0/s_axi_ctrl3]
connect_bd_intf_net [get_bd_intf_pins axi_interconnect_hpm1/M01_AXI] [get_bd_intf_pins mipi_csi2_rx0/ctrl]
connect_bd_intf_net [get_bd_intf_pins axi_interconnect_hp1/S00_AXI] [get_bd_intf_pins mipi_csi2_rx1/M_AXI_S2MM]
connect_bd_intf_net [get_bd_intf_pins axi_interconnect_hp1/S01_AXI] [get_bd_intf_pins mipi_csi2_rx0/M_AXI_S2MM]
connect_bd_intf_net [get_bd_intf_pins axi_interconnect_hpm1/M09_AXI] [get_bd_intf_pins mipi_csi2_rx1/s_axi_CTRL2]
connect_bd_intf_net [get_bd_intf_pins axi_interconnect_hpm1/M06_AXI] [get_bd_intf_pins mipi_csi2_rx1/s_axi_ctrl3]
connect_bd_intf_net [get_bd_intf_pins axi_interconnect_hpm1/M02_AXI] [get_bd_intf_pins mipi_csi2_rx0/s_axi_ctrl]
connect_bd_intf_net [get_bd_intf_pins axi_interconnect_hpm1/M08_AXI] [get_bd_intf_pins mipi_csi2_rx1/s_axi_ctrl]
connect_bd_intf_net [get_bd_intf_pins axi_interconnect_hpm0/S00_AXI] [get_bd_intf_pins zynq_ultra_ps_e_0/M_AXI_HPM0_FPD]
connect_bd_intf_net [get_bd_intf_pins axi_interconnect_hpm1/S00_AXI] [get_bd_intf_pins zynq_ultra_ps_e_0/M_AXI_HPM1_FPD]
connect_bd_intf_net [get_bd_intf_ports csi_mipi_phy_if0] [get_bd_intf_pins mipi_csi2_rx0/mipi_phy_if_0]
connect_bd_intf_net [get_bd_intf_ports csi_mipi_phy_if1] [get_bd_intf_pins mipi_csi2_rx1/mipi_phy_if_0]
connect_bd_intf_net [get_bd_intf_ports push_buttons_5bits] [get_bd_intf_pins axi_gpio_0/GPIO]
connect_bd_intf_net [get_bd_intf_ports sensor0_iic] [get_bd_intf_pins sensor0_iic/IIC]
connect_bd_intf_net [get_bd_intf_ports sensor1_iic] [get_bd_intf_pins sensor1_iic/IIC]
connect_bd_net [get_bd_pins axi_intc_0/irq] [get_bd_pins interrupts0/In0]
connect_bd_net -net clk_150mhz [get_bd_pins clk_wiz_1/clk_out4] \
  [get_bd_pins axi_interconnect_hp1/ACLK] [get_bd_pins axi_interconnect_hp1/M00_ACLK] \
  [get_bd_pins axi_interconnect_hp1/S00_ACLK] [get_bd_pins axi_interconnect_hp1/S01_ACLK] \
  [get_bd_pins axi_interconnect_hpm1/ACLK] [get_bd_pins axi_interconnect_hpm1/M00_ACLK] \
  [get_bd_pins axi_interconnect_hpm1/M01_ACLK] [get_bd_pins axi_interconnect_hpm1/M02_ACLK] \
  [get_bd_pins axi_interconnect_hpm1/M03_ACLK] [get_bd_pins axi_interconnect_hpm1/M04_ACLK] \
  [get_bd_pins axi_interconnect_hpm1/M05_ACLK] [get_bd_pins axi_interconnect_hpm1/M06_ACLK] \
  [get_bd_pins axi_interconnect_hpm1/M07_ACLK] [get_bd_pins axi_interconnect_hpm1/M08_ACLK] \
  [get_bd_pins axi_interconnect_hpm1/M09_ACLK] [get_bd_pins axi_interconnect_hpm1/M10_ACLK] \
  [get_bd_pins axi_interconnect_hpm1/M11_ACLK] [get_bd_pins axi_interconnect_hpm1/M12_ACLK] \
  [get_bd_pins axi_interconnect_hpm1/M13_ACLK] [get_bd_pins axi_interconnect_hpm1/M14_ACLK] \
  [get_bd_pins axi_interconnect_hpm1/M15_ACLK] [get_bd_pins axi_interconnect_hpm1/M16_ACLK] \
  [get_bd_pins axi_interconnect_hpm1/M17_ACLK] [get_bd_pins axi_interconnect_hpm1/M18_ACLK] \
  [get_bd_pins axi_interconnect_hpm1/S00_ACLK] [get_bd_pins mipi_csi2_rx0/m_axi_s2mm_aclk] \
  [get_bd_pins mipi_csi2_rx1/m_axi_s2mm_aclk] [get_bd_pins zynq_ultra_ps_e_0/maxihpm1_fpd_aclk] \
  [get_bd_pins zynq_ultra_ps_e_0/saxihp1_fpd_aclk]
connect_bd_net -net clk_50mhz [get_bd_pins clk_wiz_1/clk_out1] \
  [get_bd_pins axi_gpio_0/s_axi_aclk] [get_bd_pins axi_intc_0/s_axi_aclk] [get_bd_pins axi_interconnect_hpm0/ACLK] \
  [get_bd_pins axi_interconnect_hpm0/M00_ACLK] [get_bd_pins axi_interconnect_hpm0/M01_ACLK] \
  [get_bd_pins axi_interconnect_hpm0/M02_ACLK] [get_bd_pins axi_interconnect_hpm0/M03_ACLK] \
  [get_bd_pins axi_interconnect_hpm0/M04_ACLK] [get_bd_pins axi_interconnect_hpm0/M05_ACLK] \
  [get_bd_pins axi_interconnect_hpm0/S00_ACLK] [get_bd_pins mipi_csi2_rx0/s_axi_lite_aclk] \
  [get_bd_pins mipi_csi2_rx1/s_axi_lite_aclk] [get_bd_pins proc_sys_reset_1/slowest_sync_clk] \
  [get_bd_pins sensor0_iic/s_axi_aclk] [get_bd_pins sensor1_iic/s_axi_aclk] [get_bd_pins zynq_ultra_ps_e_0/maxihpm0_fpd_aclk]
connect_bd_net [get_bd_pins clk_wiz_1/clk_out5] [get_bd_pins mipi_csi2_rx0/dphy_clk_200M] [get_bd_pins mipi_csi2_rx1/dphy_clk_200M]
connect_bd_net [get_bd_pins clk_wiz_1/locked] [get_bd_pins proc_sys_reset_1/dcm_locked]
connect_bd_net -net gpio_Dout [get_bd_pins zynq_ultra_ps_e_0/pl_resetn0] [get_bd_pins proc_sys_reset_1/ext_reset_in]
connect_bd_net -net interrupts0_dout [get_bd_pins platform_interrupts/dout] [get_bd_pins axi_intc_0/intr]
connect_bd_net [get_bd_pins interrupts0/dout] [get_bd_pins zynq_ultra_ps_e_0/pl_ps_irq0]
connect_bd_net [get_bd_pins mipi_csi2_rx0/csirxss_csi_irq] [get_bd_pins platform_interrupts/In2]
connect_bd_net [get_bd_pins mipi_csi2_rx0/s2mm_introut] [get_bd_pins platform_interrupts/In3]
connect_bd_net [get_bd_pins mipi_csi2_rx1/Dout] [get_bd_ports sensor1_gpio_rst]
connect_bd_net [get_bd_pins mipi_csi2_rx1/csirxss_csi_irq] [get_bd_pins platform_interrupts/In4]
connect_bd_net [get_bd_pins mipi_csi2_rx1/dout1] [get_bd_ports sensor1_gpio_flash] [get_bd_ports sensor1_gpio_spi_cs_n]
connect_bd_net [get_bd_pins mipi_csi2_rx1/s2mm_introut] [get_bd_pins platform_interrupts/In5]
connect_bd_net -net mipi_csi2_rx_Dout [get_bd_pins mipi_csi2_rx0/Dout] [get_bd_ports sensor0_gpio_rst]
connect_bd_net -net proc_sys_reset_clk50_interconnect_aresetn [get_bd_pins proc_sys_reset_1/interconnect_aresetn] \
  [get_bd_pins axi_interconnect_hp1/ARESETN] [get_bd_pins axi_interconnect_hpm0/ARESETN] \
  [get_bd_pins axi_interconnect_hpm1/ARESETN]
connect_bd_net -net proc_sys_reset_clk50_peripheral_aresetn [get_bd_pins proc_sys_reset_1/peripheral_aresetn] \
  [get_bd_pins axi_gpio_0/s_axi_aresetn] [get_bd_pins axi_intc_0/s_axi_aresetn] \
  [get_bd_pins axi_interconnect_hp1/M00_ARESETN] [get_bd_pins axi_interconnect_hp1/S00_ARESETN] \
  [get_bd_pins axi_interconnect_hp1/S01_ARESETN] [get_bd_pins axi_interconnect_hpm0/M00_ARESETN] \
  [get_bd_pins axi_interconnect_hpm0/M01_ARESETN] [get_bd_pins axi_interconnect_hpm0/M02_ARESETN] \
  [get_bd_pins axi_interconnect_hpm0/M03_ARESETN] [get_bd_pins axi_interconnect_hpm0/M04_ARESETN] \
  [get_bd_pins axi_interconnect_hpm0/M05_ARESETN] [get_bd_pins axi_interconnect_hpm0/S00_ARESETN] \
  [get_bd_pins axi_interconnect_hpm1/M00_ARESETN] [get_bd_pins axi_interconnect_hpm1/M01_ARESETN] \
  [get_bd_pins axi_interconnect_hpm1/M02_ARESETN] [get_bd_pins axi_interconnect_hpm1/M03_ARESETN] \
  [get_bd_pins axi_interconnect_hpm1/M04_ARESETN] [get_bd_pins axi_interconnect_hpm1/M05_ARESETN] \
  [get_bd_pins axi_interconnect_hpm1/M06_ARESETN] [get_bd_pins axi_interconnect_hpm1/M07_ARESETN] \
  [get_bd_pins axi_interconnect_hpm1/M08_ARESETN] [get_bd_pins axi_interconnect_hpm1/M09_ARESETN] \
  [get_bd_pins axi_interconnect_hpm1/M10_ARESETN] [get_bd_pins axi_interconnect_hpm1/M11_ARESETN] \
  [get_bd_pins axi_interconnect_hpm1/M12_ARESETN] [get_bd_pins axi_interconnect_hpm1/M13_ARESETN] \
  [get_bd_pins axi_interconnect_hpm1/M14_ARESETN] [get_bd_pins axi_interconnect_hpm1/M15_ARESETN] \
  [get_bd_pins axi_interconnect_hpm1/M16_ARESETN] [get_bd_pins axi_interconnect_hpm1/M17_ARESETN] \
  [get_bd_pins axi_interconnect_hpm1/M18_ARESETN] [get_bd_pins axi_interconnect_hpm1/S00_ARESETN] \
  [get_bd_pins mipi_csi2_rx0/axi_resetn] [get_bd_pins mipi_csi2_rx0/video_aresetn] [get_bd_pins mipi_csi2_rx1/axi_resetn] \
  [get_bd_pins mipi_csi2_rx1/video_aresetn] [get_bd_pins sensor0_iic/s_axi_aresetn] [get_bd_pins sensor1_iic/s_axi_aresetn]
connect_bd_net [get_bd_pins sensor0_iic/iic2intc_irpt] [get_bd_pins platform_interrupts/In0]
connect_bd_net [get_bd_pins sensor1_iic/iic2intc_irpt] [get_bd_pins platform_interrupts/In1]
connect_bd_net -net vcc_dout_gpio [get_bd_pins mipi_csi2_rx0/dout1] [get_bd_ports sensor0_gpio_flash] [get_bd_ports sensor0_gpio_spi_cs_n]
connect_bd_net [get_bd_pins zynq_ultra_ps_e_0/emio_gpio_o] [get_bd_pins mipi_csi2_rx0/Din] [get_bd_pins mipi_csi2_rx1/Din]
connect_bd_net [get_bd_pins zynq_ultra_ps_e_0/pl_clk0] [get_bd_pins clk_wiz_1/clk_in1]

# ---- address map ----
assign_bd_address -offset 0x00000000 -range 2G -target_address_space [get_bd_addr_spaces mipi_csi2_rx0/v_frmbuf_wr_0/Data_m_axi_mm_video] [get_bd_addr_segs zynq_ultra_ps_e_0/SAXIGP3/HP1_DDR_LOW]
assign_bd_address -offset 0xC0000000 -range 512M -target_address_space [get_bd_addr_spaces mipi_csi2_rx0/v_frmbuf_wr_0/Data_m_axi_mm_video] [get_bd_addr_segs zynq_ultra_ps_e_0/SAXIGP3/HP1_QSPI]
assign_bd_address -offset 0xFFFC0000 -range 256K -target_address_space [get_bd_addr_spaces mipi_csi2_rx0/v_frmbuf_wr_0/Data_m_axi_mm_video] [get_bd_addr_segs zynq_ultra_ps_e_0/SAXIGP3/HP1_LPS_OCM]
assign_bd_address -offset 0x00000000 -range 2G -target_address_space [get_bd_addr_spaces mipi_csi2_rx1/v_frmbuf_wr_0/Data_m_axi_mm_video] [get_bd_addr_segs zynq_ultra_ps_e_0/SAXIGP3/HP1_DDR_LOW]
assign_bd_address -offset 0xC0000000 -range 512M -target_address_space [get_bd_addr_spaces mipi_csi2_rx1/v_frmbuf_wr_0/Data_m_axi_mm_video] [get_bd_addr_segs zynq_ultra_ps_e_0/SAXIGP3/HP1_QSPI]
assign_bd_address -offset 0xFFFC0000 -range 256K -target_address_space [get_bd_addr_spaces mipi_csi2_rx1/v_frmbuf_wr_0/Data_m_axi_mm_video] [get_bd_addr_segs zynq_ultra_ps_e_0/SAXIGP3/HP1_LPS_OCM]
assign_bd_address -offset 0x000A0000000 -range 64K -target_address_space [get_bd_addr_spaces zynq_ultra_ps_e_0/Data] [get_bd_addr_segs mipi_csi2_rx1/mipi_csi2_rx_subsystem_0/csirxss_s_axi/Reg]
assign_bd_address -offset 0x000A0010000 -range 64K -target_address_space [get_bd_addr_spaces zynq_ultra_ps_e_0/Data] [get_bd_addr_segs axi_intc_0/S_AXI/Reg]
assign_bd_address -offset 0x000A0020000 -range 64K -target_address_space [get_bd_addr_spaces zynq_ultra_ps_e_0/Data] [get_bd_addr_segs sensor1_iic/S_AXI/Reg]
assign_bd_address -offset 0x000A0030000 -range 4K -target_address_space [get_bd_addr_spaces zynq_ultra_ps_e_0/Data] [get_bd_addr_segs axi_gpio_0/S_AXI/Reg]
assign_bd_address -offset 0x000A0060000 -range 64K -target_address_space [get_bd_addr_spaces zynq_ultra_ps_e_0/Data] [get_bd_addr_segs mipi_csi2_rx0/mipi_csi2_rx_subsystem_0/csirxss_s_axi/Reg]
assign_bd_address -offset 0x000A00A0000 -range 64K -target_address_space [get_bd_addr_spaces zynq_ultra_ps_e_0/Data] [get_bd_addr_segs sensor0_iic/S_AXI/Reg]
assign_bd_address -offset 0x000B0000000 -range 64K -target_address_space [get_bd_addr_spaces zynq_ultra_ps_e_0/Data] [get_bd_addr_segs mipi_csi2_rx1/v_proc_ss_csc/s_axi_ctrl/Reg]
assign_bd_address -offset 0x000B0010000 -range 64K -target_address_space [get_bd_addr_spaces zynq_ultra_ps_e_0/Data] [get_bd_addr_segs mipi_csi2_rx0/v_gamma_lut_0/s_axi_CTRL/Reg]
assign_bd_address -offset 0x000B0020000 -range 64K -target_address_space [get_bd_addr_spaces zynq_ultra_ps_e_0/Data] [get_bd_addr_segs mipi_csi2_rx0/v_frmbuf_wr_0/s_axi_CTRL/Reg]
assign_bd_address -offset 0x000B0030000 -range 64K -target_address_space [get_bd_addr_spaces zynq_ultra_ps_e_0/Data] [get_bd_addr_segs mipi_csi2_rx1/v_demosaic_0/s_axi_CTRL/Reg]
assign_bd_address -offset 0x000B0040000 -range 64K -target_address_space [get_bd_addr_spaces zynq_ultra_ps_e_0/Data] [get_bd_addr_segs mipi_csi2_rx0/v_demosaic_0/s_axi_CTRL/Reg]
assign_bd_address -offset 0x000B0050000 -range 64K -target_address_space [get_bd_addr_spaces zynq_ultra_ps_e_0/Data] [get_bd_addr_segs mipi_csi2_rx1/v_frmbuf_wr_0/s_axi_CTRL/Reg]
assign_bd_address -offset 0x000B0060000 -range 64K -target_address_space [get_bd_addr_spaces zynq_ultra_ps_e_0/Data] [get_bd_addr_segs mipi_csi2_rx0/v_proc_ss_csc/s_axi_ctrl/Reg]
assign_bd_address -offset 0x000B0070000 -range 64K -target_address_space [get_bd_addr_spaces zynq_ultra_ps_e_0/Data] [get_bd_addr_segs mipi_csi2_rx1/v_gamma_lut_0/s_axi_CTRL/Reg]
assign_bd_address -offset 0x000B0080000 -range 256K -target_address_space [get_bd_addr_spaces zynq_ultra_ps_e_0/Data] [get_bd_addr_segs mipi_csi2_rx0/v_proc_ss_scaler/s_axi_ctrl/Reg]
assign_bd_address -offset 0x000B00C0000 -range 256K -target_address_space [get_bd_addr_spaces zynq_ultra_ps_e_0/Data] [get_bd_addr_segs mipi_csi2_rx1/v_proc_ss_scaler/s_axi_ctrl/Reg]

validate_bd_design
save_bd_design
